# Altium schematic sheet sch_qtouch.SchDoc: X
size A4; Date: DD-MM-YYYY; CheckedBy: X; DrawnBy: Y; Revision: 0.0.0; SheetNumber: X; SheetTotal: Y; Projectnumber: OWN-000; Size: A4; Projectname: X
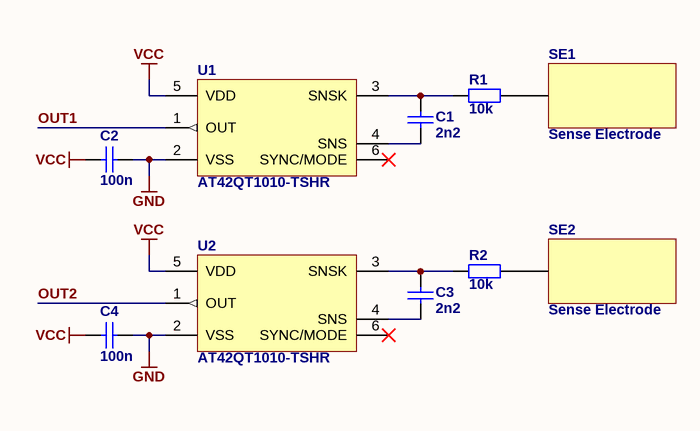
[diagram p0: sch_qtouch.SchDoc]

## Parts
C1  2n2  [C0603]
C2  100n  [C0603]
C3  2n2  [C0603]
C4  100n  [C0603]
R1  10k  [R0603]
R2  10k  [R0603]
SE1  Sense Electrode  [SNS_EL_CIRC_1cm]
SE2  Sense Electrode  [SNS_EL_CIRC_1cm]
U1  AT42QT1010-TSHR  [SOT-23-6]
U2  AT42QT1010-TSHR  [SOT-23-6]

## Nets
GND: C2.1 C4.1 U1.2(VSS) U2.2(VSS)
VCC: C2.2 C4.2 U1.5(VDD) U2.5(VDD)
OUT1: U1.1(OUT)
OUT2: U2.1(OUT)
NetC1_1: C1.1 U1.4(SNS)
NetC1_2: C1.2 R1.1 U1.3(SNSK)
NetC3_1: C3.1 U2.4(SNS)
NetC3_2: C3.2 R2.1 U2.3(SNSK)
NetR1_2: R1.2 SE1.1(SE)
NetR2_2: R2.2 SE2.1(SE)

Not connected (* = marked no-connect by the designer): U1 6(SYNC/MODE)*; U2 6(SYNC/MODE)*

## Notes on the sheet
- PROJECT NAME:
- PROJECT NO.:
- DATE:
- TITLE:
- SHEET
- of
- DRAWN BY:
- REVISION:
- FILENAME:
- A4

## Library data of the parts
C1-C4 = Cap: Capacitor; ComponentLink1Description: datasheet; ComponentLink2Description: supplier
  C1 C3: Value: 2n2
  C2 C4: Value: 100n
R1 R2 = Res: Resistor; Published: 19-Feb-2006; ComponentLink1Description: datasheet; ComponentLink2Description: supplier; Value: 10k
SE1 SE2 = _SNS_EL_CIRC_1cm: Circular (1cm Diameter) Sense Electrode
U1 U2 = AT42QT1010-TSHR: Atmel Single-key QTouch Touch Sensor IC; Supplier 1: Farnell; Supplier 2: Farnell; Supplier 3: TME; Supplier Part Number 1: 1841593RL; Supplier Part Number 2: 1841593; Supplier Part Number 3: AT42QT1010-TSHR